# EAGLE schematic 00A-001 (EAGLE 6.3)
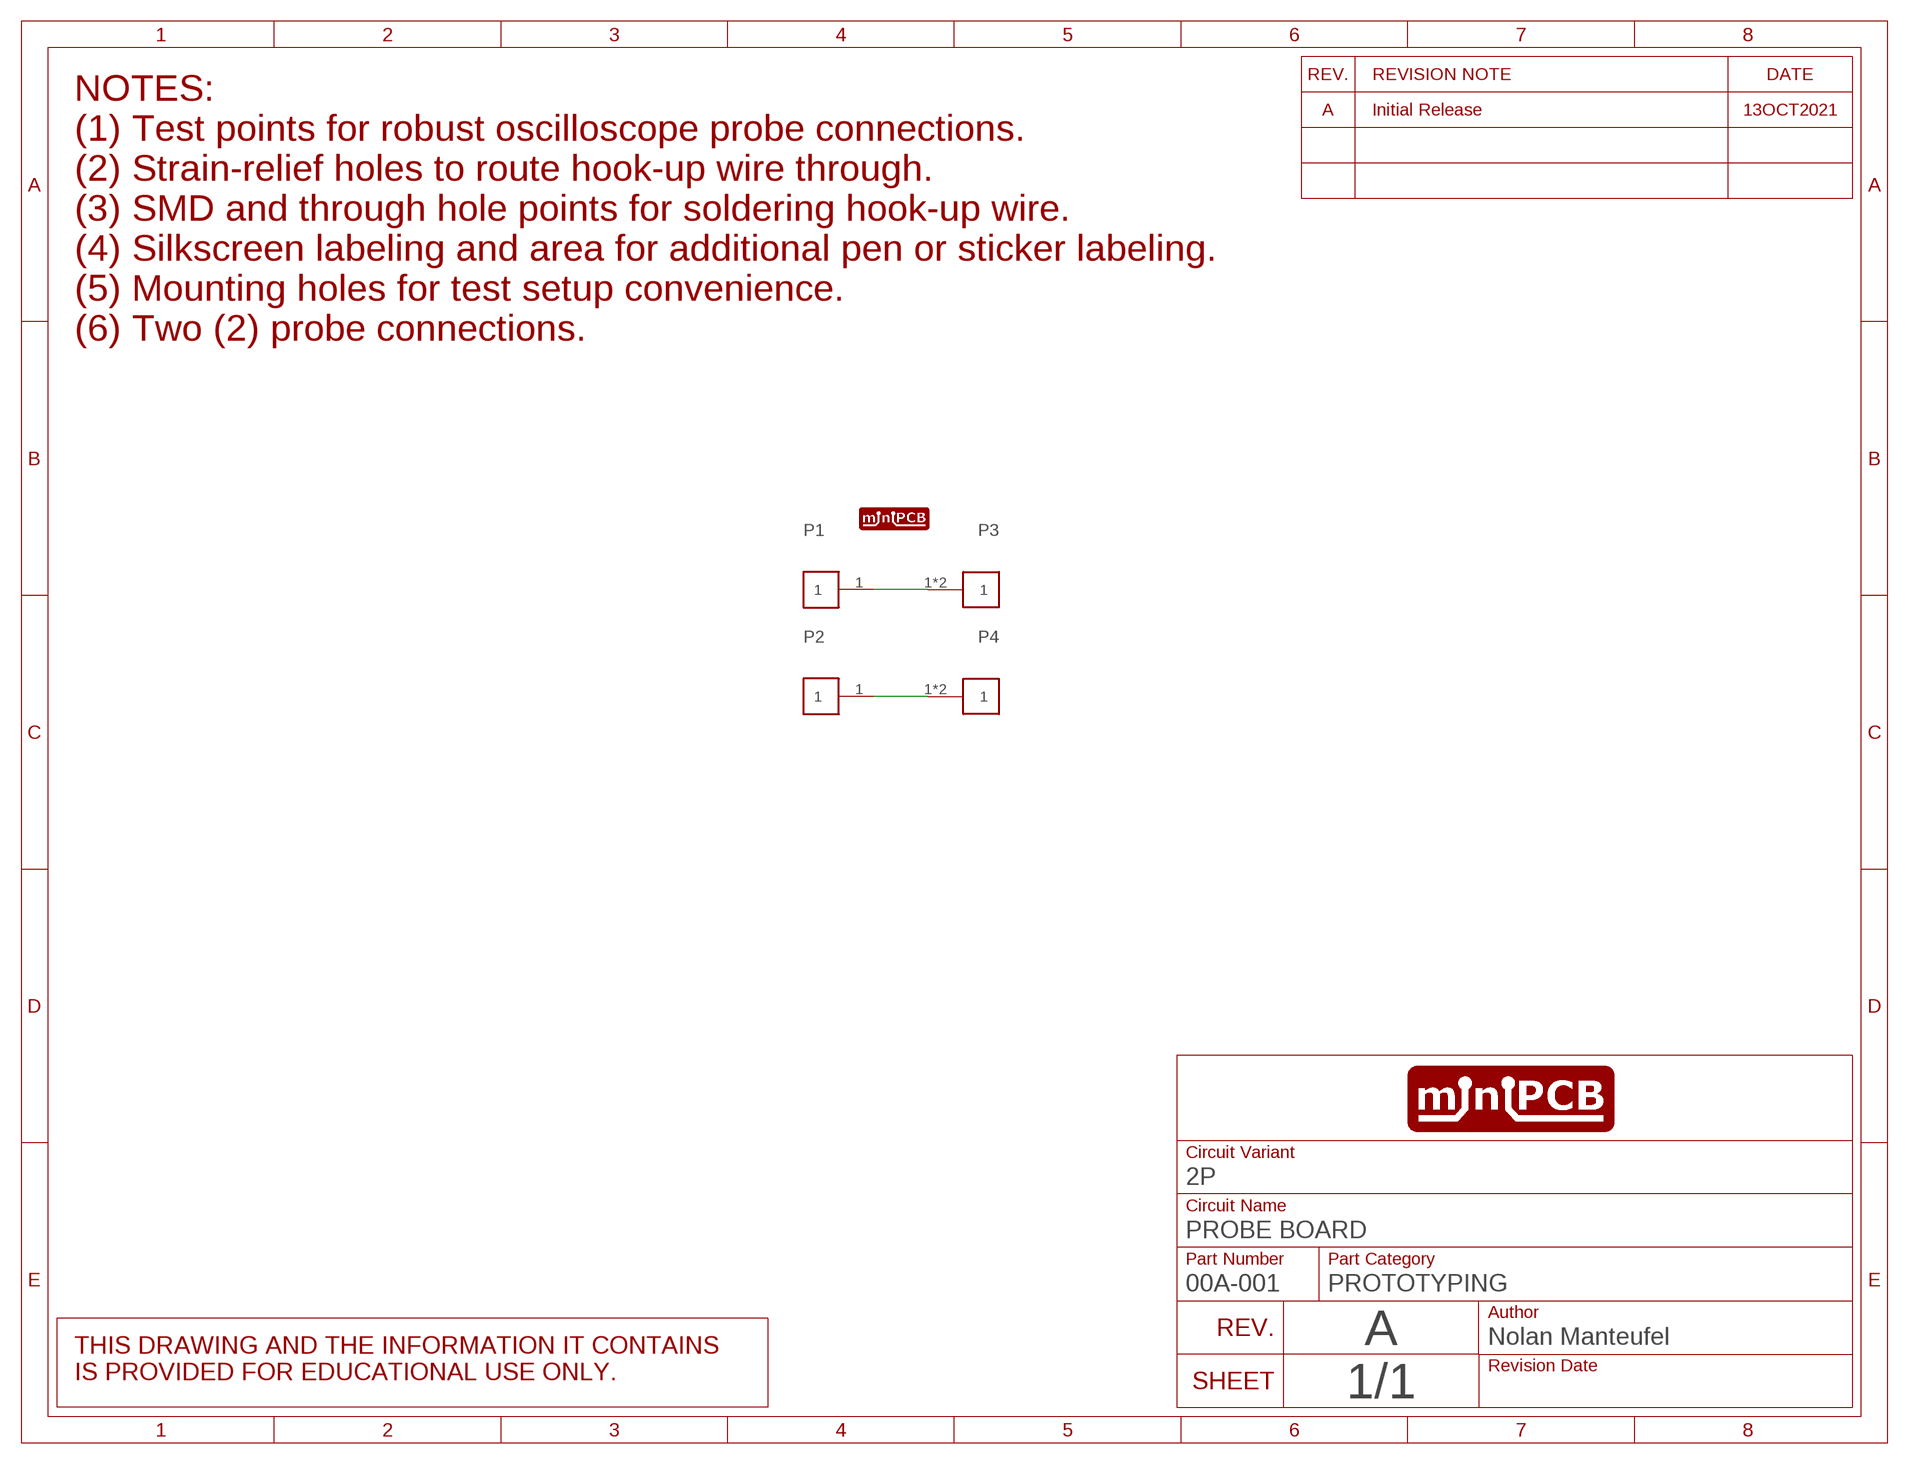
[diagram p0: schematic, sheet 1]
SHEET1 (SCHEMATIC): CIRCUIT_CATEGORY: PROTOTYPING; CIRCUIT_NAME: PROBE BOARD; REVISION: A

## Parts
P1  PINS_1KE_5000  [PINS_1_TESTPOINT_KE5000]
P2  PINS_1KE_5000  [PINS_1_TESTPOINT_KE5000]
P3  PINS_124AWG  [PINS_1_1MM]
P4  PINS_124AWG  [PINS_1_1MM]
U$1  MINIPCB_LOGO  [MINIPCB-LOGO]

## Nets
N$1: P1.1 P3.1 P3.2
N$2: P2.1 P4.1 P4.2

## Notes on the sheet
- NOTES:
  (1) Test points for robust oscilloscope probe connections.
  (2) Strain-relief holes to route hook-up wire through.
  (3) SMD and through hole points for soldering hook-up wire.
  (4) Silkscreen labeling and area for additional pen or sticker labeling.
  (5) Mounting holes for test setup convenience.
  (6) Two (2) probe connections.
- 13OCT2021

## Library data of the parts
P1-P4 = nolan-utsa:PINS_1
U$1 = minipcb:MINIPCB_LOGO